# EAGLE schematic rhoby_motor (EAGLE 8.7.0)
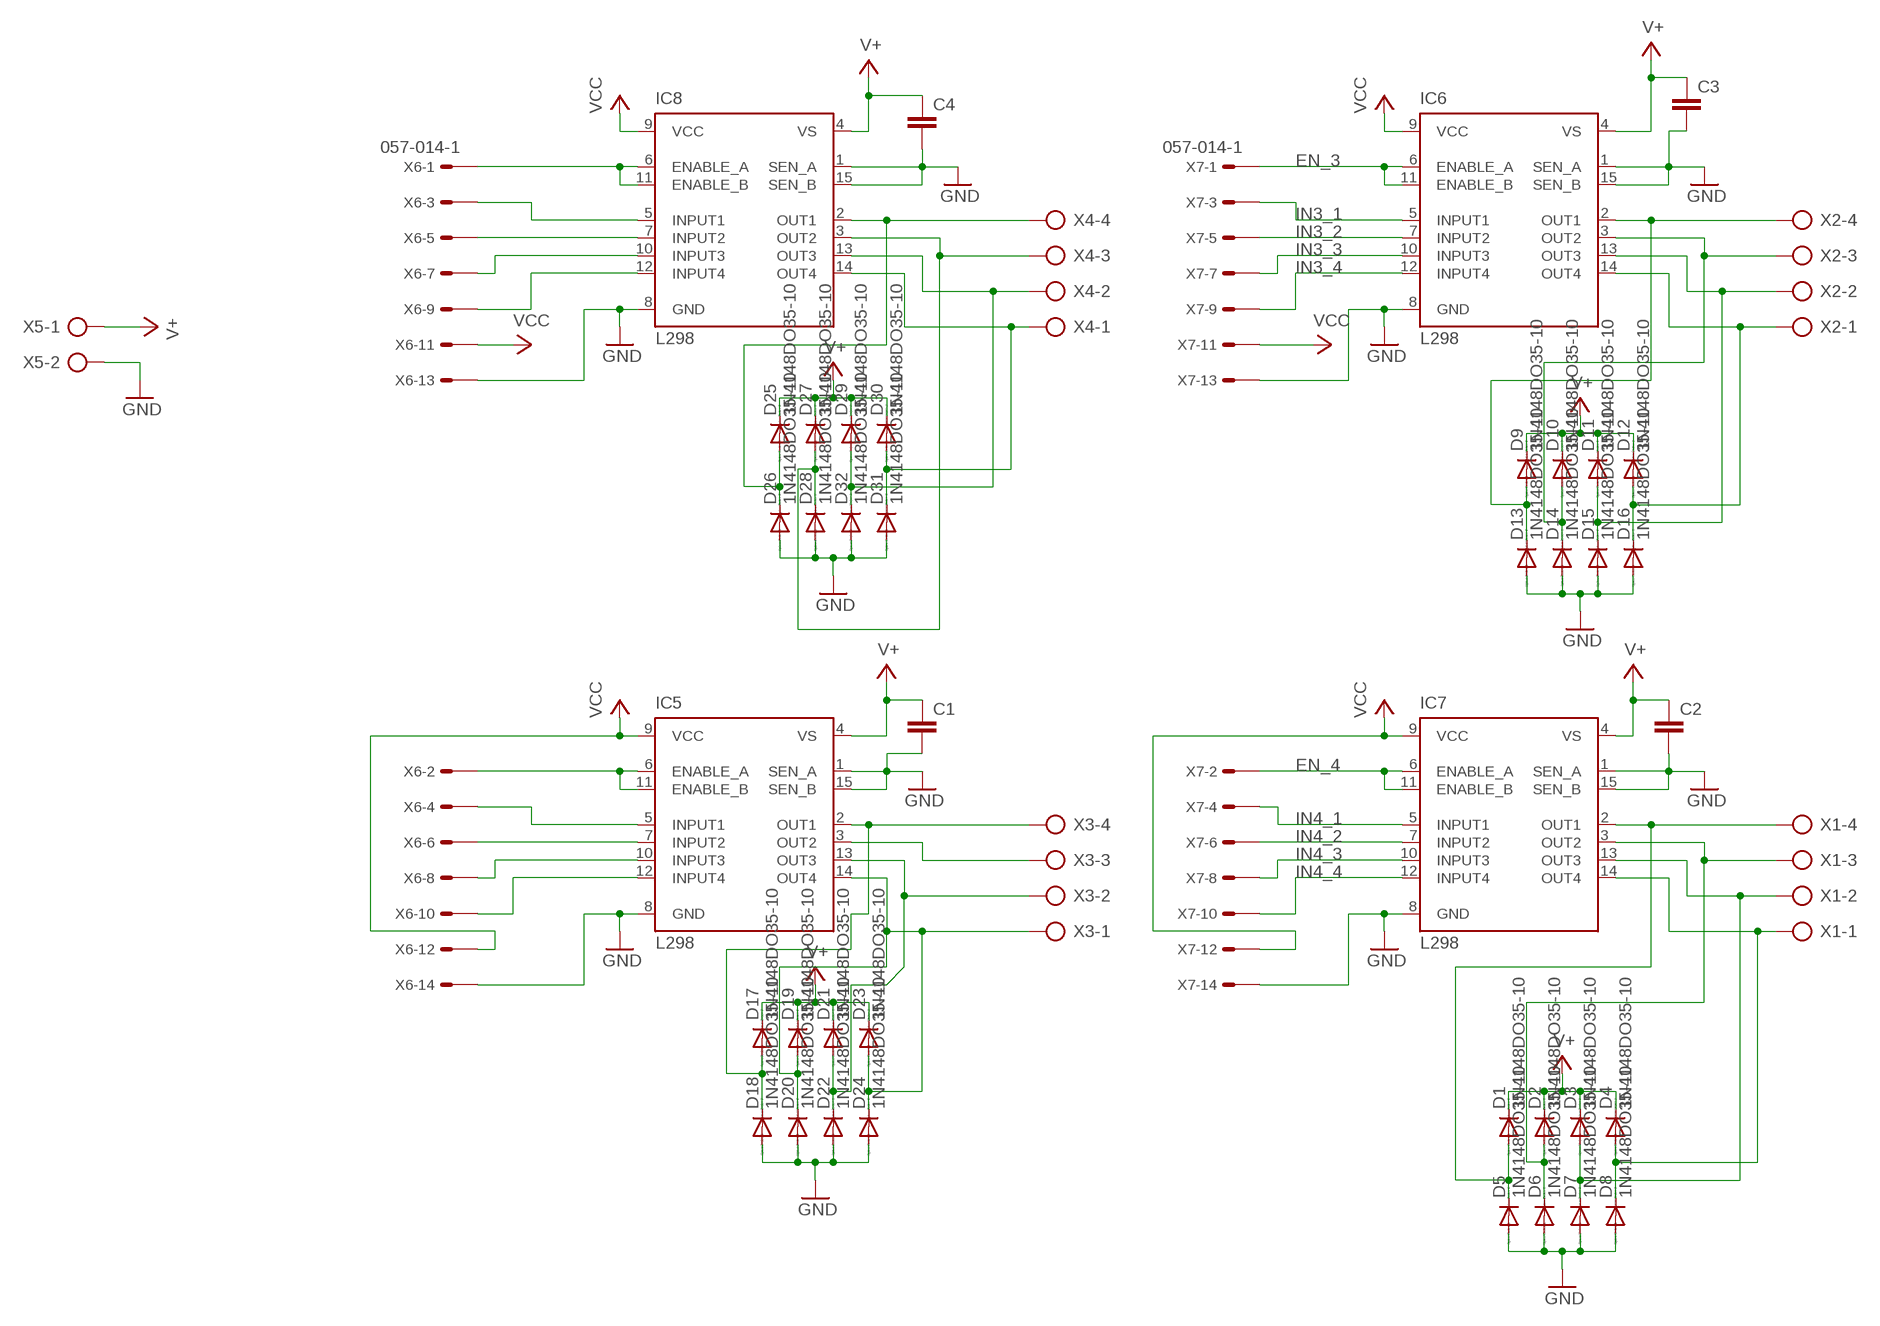
[diagram p0: schematic, sheet 1]

## Parts
C1  C-EUC1210  [C1210]
C2  C-EUC1210  [C1210]
C3  C-EUC1210  [C1210]
C4  C-EUC1210  [C1210]
D1  1N4148DO35-10  [DO35-10]
D2  1N4148DO35-10  [DO35-10]
D3  1N4148DO35-10  [DO35-10]
D4  1N4148DO35-10  [DO35-10]
D5  1N4148DO35-10  [DO35-10]
D6  1N4148DO35-10  [DO35-10]
D7  1N4148DO35-10  [DO35-10]
D8  1N4148DO35-10  [DO35-10]
D9  1N4148DO35-10  [DO35-10]
D10  1N4148DO35-10  [DO35-10]
D11  1N4148DO35-10  [DO35-10]
D12  1N4148DO35-10  [DO35-10]
D13  1N4148DO35-10  [DO35-10]
D14  1N4148DO35-10  [DO35-10]
D15  1N4148DO35-10  [DO35-10]
D16  1N4148DO35-10  [DO35-10]
D17  1N4148DO35-10  [DO35-10]
D18  1N4148DO35-10  [DO35-10]
D19  1N4148DO35-10  [DO35-10]
D20  1N4148DO35-10  [DO35-10]
D21  1N4148DO35-10  [DO35-10]
D22  1N4148DO35-10  [DO35-10]
D23  1N4148DO35-10  [DO35-10]
D24  1N4148DO35-10  [DO35-10]
D25  1N4148DO35-10  [DO35-10]
D26  1N4148DO35-10  [DO35-10]
D27  1N4148DO35-10  [DO35-10]
D28  1N4148DO35-10  [DO35-10]
D29  1N4148DO35-10  [DO35-10]
D30  1N4148DO35-10  [DO35-10]
D31  1N4148DO35-10  [DO35-10]
D32  1N4148DO35-10  [DO35-10]
IC5  L298  [MULTIWATT-15]
IC6  L298  [MULTIWATT-15]
IC7  L298  [MULTIWATT-15]
IC8  L298  [MULTIWATT-15]
X1  AK500/4  [AK500/4]
X2  AK500/4  [AK500/4]
X3  AK500/4  [AK500/4]
X4  AK500/4  [AK500/4]
X5  AK500/2  [AK500/2]
X6  057-014-1  [057-014-1]
X7  057-014-1  [057-014-1]

## Nets
EN_1: IC8.6(ENABLE_A) IC8.11(ENABLE_B) X6.1
EN_2: IC5.6(ENABLE_A) IC5.11(ENABLE_B) X6.2
EN_3: IC6.6(ENABLE_A) IC6.11(ENABLE_B) X7.1
EN_4: IC7.6(ENABLE_A) IC7.11(ENABLE_B) X7.2
GND: C1.2 C2.2 C3.2 C4.2 D5.A D6.A D7.A D8.A D13.A D14.A D15.A D16.A D18.A D20.A D22.A D24.A D26.A D28.A D31.A D32.A IC5.1(SEN_A) IC5.8(GND) IC5.15(SEN_B) IC6.1(SEN_A) IC6.8(GND) IC6.15(SEN_B) IC7.1(SEN_A) IC7.8(GND) IC7.15(SEN_B) IC8.1(SEN_A) IC8.8(GND) IC8.15(SEN_B) X5.2 X6.13 X6.14 X7.13 X7.14
IN1_1: IC8.5(INPUT1) X6.3
IN1_2: IC8.7(INPUT2) X6.5
IN1_3: IC8.10(INPUT3) X6.7
IN1_4: IC8.12(INPUT4) X6.9
IN2_1: IC5.5(INPUT1) X6.4
IN2_2: IC5.7(INPUT2) X6.6
IN2_3: IC5.10(INPUT3) X6.8
IN2_4: IC5.12(INPUT4) X6.10
IN3_1: IC6.5(INPUT1) X7.3
IN3_2: IC6.7(INPUT2) X7.5
IN3_3: IC6.10(INPUT3) X7.7
IN3_4: IC6.12(INPUT4) X7.9
IN4_1: IC7.5(INPUT1) X7.4
IN4_2: IC7.7(INPUT2) X7.6
IN4_3: IC7.10(INPUT3) X7.8
IN4_4: IC7.12(INPUT4) X7.10
N$1: IC5.3(OUT2) X3.3
N$4: D25.A D26.C IC8.2(OUT1) X4.4
N$5: D27.A D28.C IC8.3(OUT2) X4.3
N$6: D29.A D32.C IC8.13(OUT3) X4.2
N$7: D30.A D31.C IC8.14(OUT4) X4.1
N$12: D1.A D5.C IC7.2(OUT1) X1.4
N$13: D2.A D6.C IC7.3(OUT2) X1.3
N$14: D3.A D7.C IC7.13(OUT3) X1.2
N$15: D4.A D8.C IC7.14(OUT4) X1.1
N$16: D9.A D13.C IC6.2(OUT1) X2.4
N$17: D10.A D14.C IC6.3(OUT2) X2.3
N$18: D11.A D15.C IC6.13(OUT3) X2.2
N$19: D12.A D16.C IC6.14(OUT4) X2.1
N$21: D17.A D18.C IC5.2(OUT1) X3.4
N$22: D19.A D20.C D23.A D24.C IC5.14(OUT4) X3.1
N$23: D21.A D22.C IC5.13(OUT3) X3.2
V+: C1.1 C2.1 C3.1 C4.1 D1.C D2.C D3.C D4.C D9.C D10.C D11.C D12.C D17.C D19.C D21.C D23.C D25.C D27.C D29.C D30.C IC5.4(VS) IC6.4(VS) IC7.4(VS) IC8.4(VS) X5.1
VCC: IC5.9(VCC) IC6.9(VCC) IC7.9(VCC) IC8.9(VCC) X6.11 X6.12 X7.11 X7.12

## Library data of the parts
C1-C4 = rcl:C-EU: CAPACITOR, European symbol; SPICEPREFIX: C
D1-D32 = diode:1N4148: DIODE high speed (Philips)
IC5-IC8 = st-microelectronics:L298: DUAL FULL-BRIDGE DRIVER; MPN: L298N; OC_FARNELL: 1589425; OC_NEWARK: 32M1527
X1-X4 = con-ptr500:AK500/4: CONNECTOR; OC_FARNELL: unknown; OC_NEWARK: unknown
X5 = con-ptr500:AK500/2: CONNECTOR; OC_FARNELL: unknown; OC_NEWARK: unknown
X6 X7 = con-panduit:057-014-: CONNECTOR 10-pin series 057 contact pc board low profile headers; OC_FARNELL: unknown; OC_NEWARK: unknown